# Altium schematic sheet Pop.SchDoc
size A3
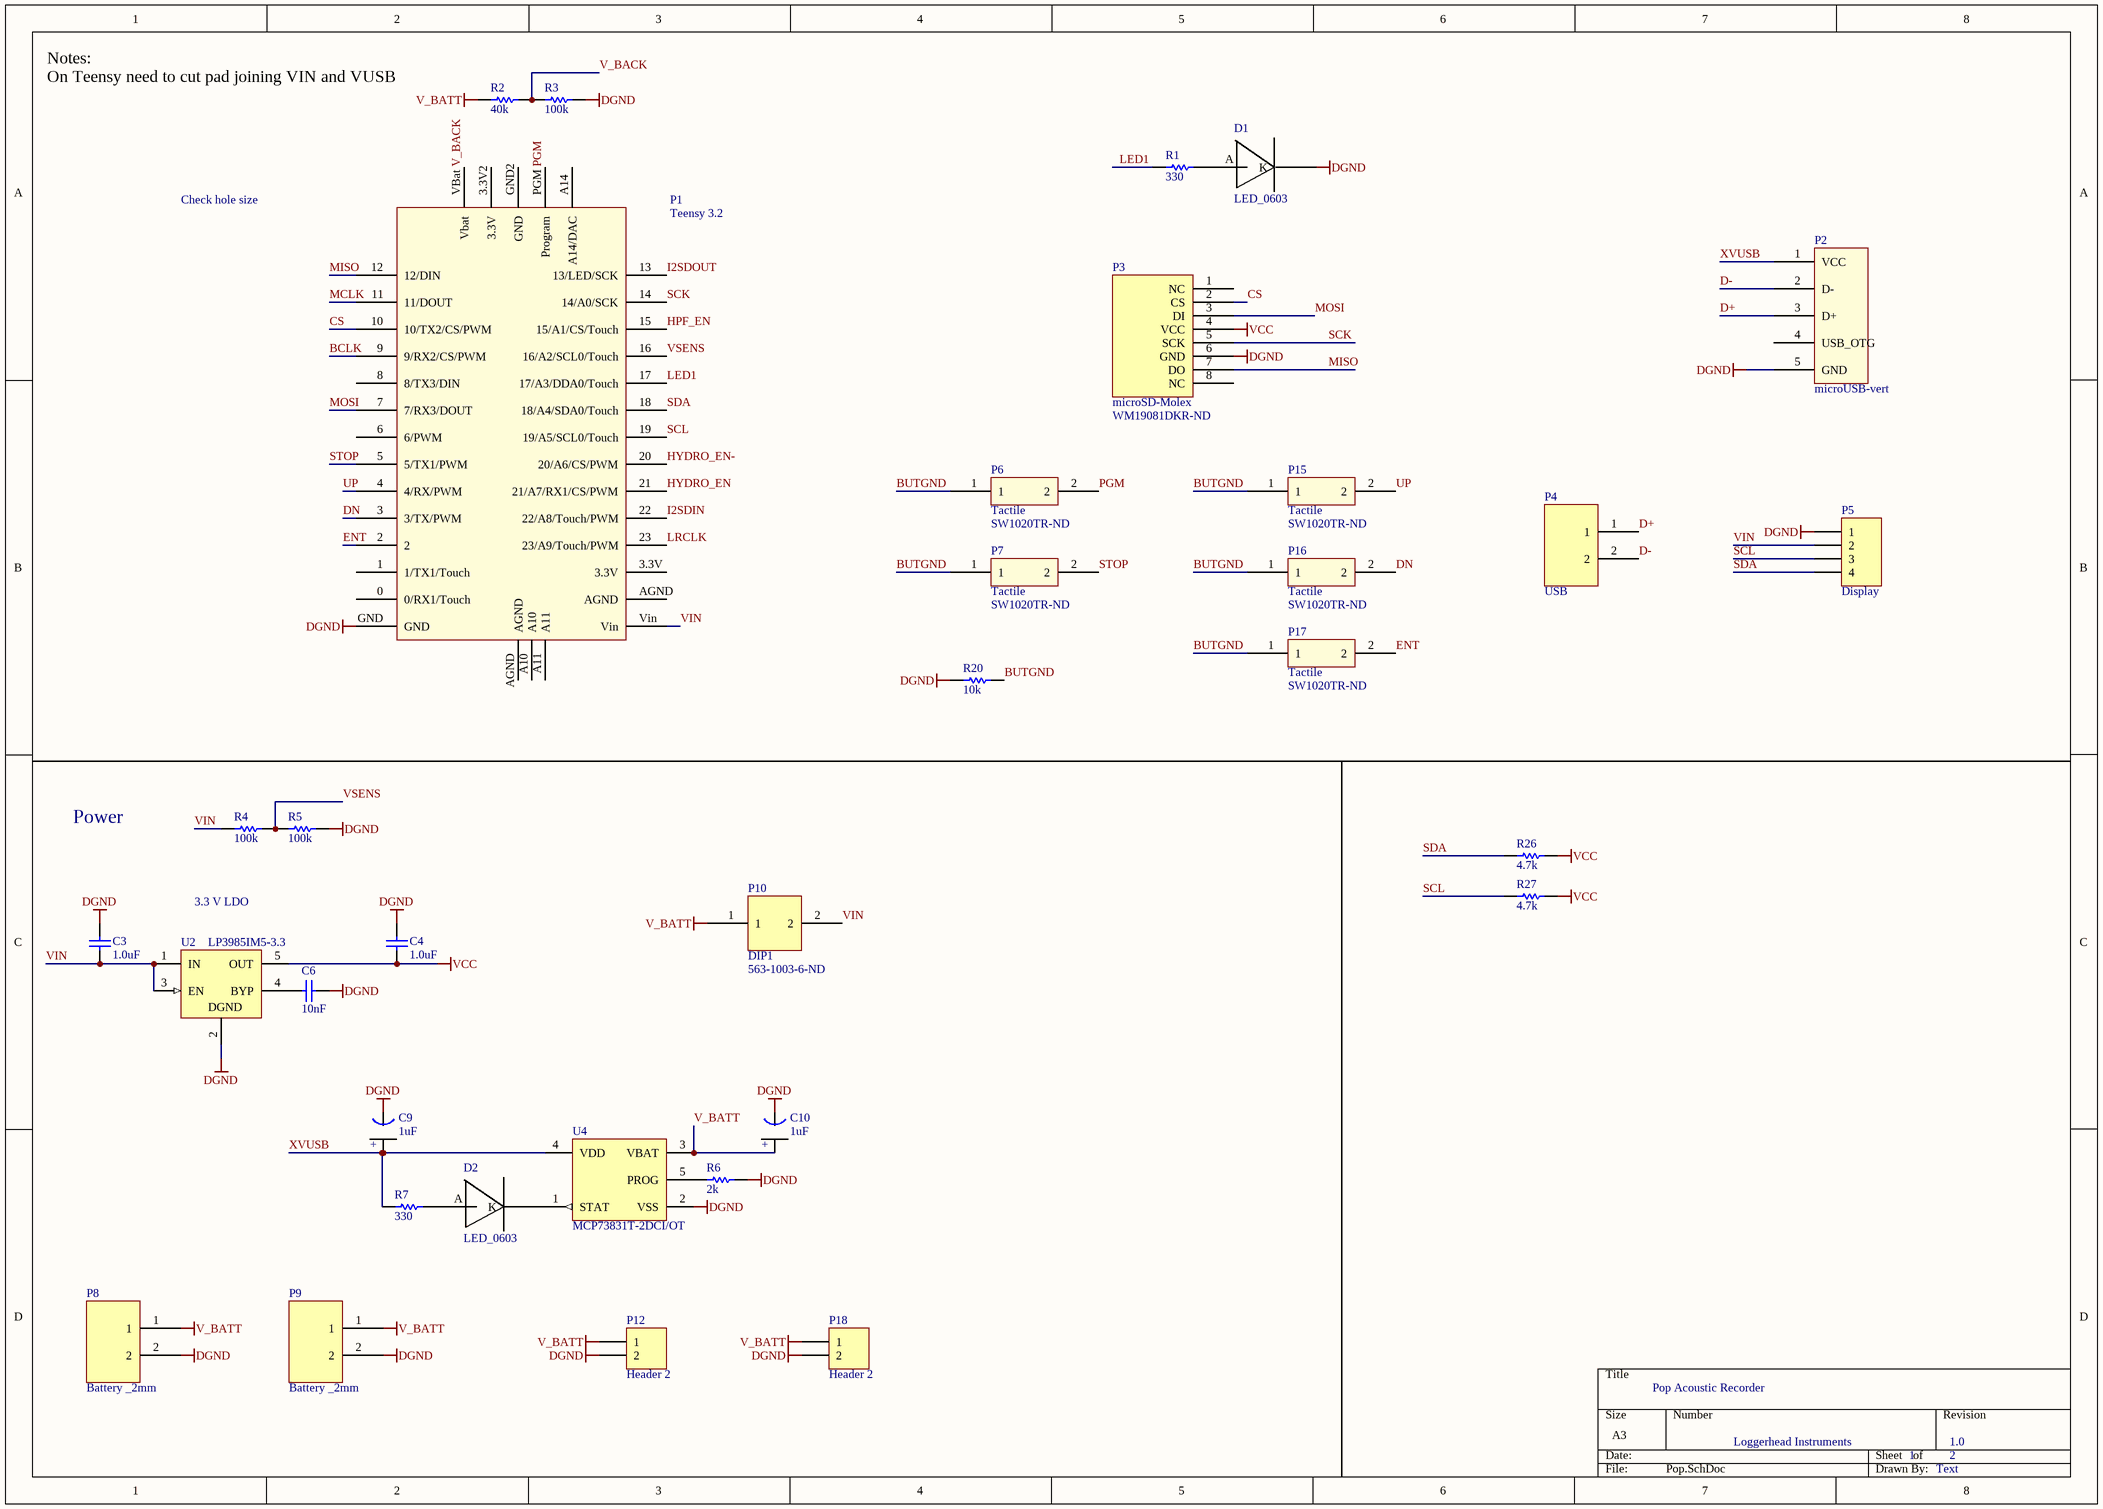
[diagram p0: Pop.SchDoc]

## Parts
C3  1.0uF  [0402]
C4  1.0uF  [0402]
C6  10nF  [0402]
C9  1uF  [Tant0805]
C10  1uF  [Tant0805]
D1  LED_0603  [Diode0603]
D2  LED_0603  [Diode0603]
P1  Teensy 3.2  [Teensy3.x]
P2  microUSB-vert  [MICROUSB-VERT]
P3  microSD-Molex  Supplier Part Number 1: WM19081DKR-ND  [microSD_Molex_hinged]
P4  USB  [HDR_2x1_2mm]
P5  Display  [HDR1X4]
P6  Tactile  Supplier Part Number 1: SW1020TR-ND  [Tactile-B3U-1000]
P7  Tactile  Supplier Part Number 1: SW1020TR-ND  [Tactile-B3U-1000]
P8  Battery _2mm  [HDR_2x1_2mm]
P9  Battery _2mm  [HDR_2x1_2mm]
P10  DIP1  Supplier Part Number 1: 563-1003-6-ND  [DIP1]
P12  Header 2  [HDR1X2]
P15  Tactile  Supplier Part Number 1: SW1020TR-ND  [Tactile-B3U-1000]
P16  Tactile  Supplier Part Number 1: SW1020TR-ND  [Tactile-B3U-1000]
P17  Tactile  Supplier Part Number 1: SW1020TR-ND  [Tactile-B3U-1000]
P18  Header 2  [HDR1X2]
R1  330  [3-0603]
R2  40k  [3-0603]
R3  100k  [3-0603]
R4  100k  [3-0603]
R5  100k  [3-0603]
R6  2k  [3-0603]
R7  330  [3-0603]
R20  10k  [3-0603]
R26  4.7k  [3-0603]
R27  4.7k  [3-0603]
U2  LP3985IM5-3.3  [MF05A_N]
U4  MCP73831T-2DCI/OT  [SOT-23-OT5_N]

## Nets
DGND: C3.2 C4.2 C6.1 C9.1(GND) C10.1(GND) D1.K P1.GND P2.5(GND) P3.6(GND) P5.1 P8.2 P9.2 P12.2 P18.2 R3.1 R5.1 R6.1 R20.2 U2.2(GND) U4.2(VSS)
V_BATT: C10.2(+) P8.1 P9.1 P10.1 P12.1 P18.1 R2.2 U4.3(VBAT)
VCC: C4.1 P3.4(VCC) R26.1 R27.2 U2.5(OUT)
BCLK: P1.9(9/RX2/CS/PWM)
BUTGND: P6.1 P7.1 P15.1 P16.1 P17.1 R20.1
CS: P1.10(10/TX2/CS/PWM) P3.2(CS)
D+: P2.3(D+) P4.1
D-: P2.2(D-) P4.2
DN: P1.3(3/TX/PWM) P16.2
ENT: P1.2 P17.2
HPF_EN: P1.15(15/A1/CS/Touch)
HYDRO_EN: P1.21(21/A7/RX1/CS/PWM)
HYDRO_EN-: P1.20(20/A6/CS/PWM)
I2SDIN: P1.22(22/A8/Touch/PWM)
I2SDOUT: P1.13(13/LED/SCK)
LED1: P1.17(17/A3/DDA0/Touch) R1.1
LRCLK: P1.23(23/A9/Touch/PWM)
MCLK: P1.11(11/DOUT)
MISO: P1.12(12/DIN) P3.7(DO)
MOSI: P1.7(7/RX3/DOUT) P3.3(DI)
PGM: P1.PGM(Program) P6.2
SCK: P1.14(14/A0/SCK) P3.5(SCK)
SCL: P1.19(19/A5/SCL0/Touch) P5.3 R27.1
SDA: P1.18(18/A4/SDA0/Touch) P5.4 R26.2
STOP: P1.5(5/TX1/PWM) P7.2
UP: P1.4(4/RX/PWM) P15.2
V_BACK: P1.VBat(Vbat) R2.1 R3.2
VIN: C3.1 P1.Vin P5.2 P10.2 R4.2 U2.1(IN) U2.3(EN)
VSENS: P1.16(16/A2/SCL0/Touch) R4.1 R5.2
XVUSB: C9.2(+) P2.1(VCC) R7.1 U4.4(VDD)
NetC6_2: C6.2 U2.4(BYP)
NetD1_A: D1.A R1.2
NetD2_A: D2.A R7.2
NetD2_K: D2.K U4.1(STAT)
NetR6_2: R6.2 U4.5(PROG)

Not connected (* = marked no-connect by the designer): P1 0(0/RX1/Touch) 1(1/TX1/Touch) 3.3V 3.3V2(3.3V) 6(6/PWM) 8(8/TX3/DIN) A10 A11 A14(A14/DAC) AGND GND2(GND); P2 4(USB_OTG); P3 1(NC) 8(NC)

## Notes on the sheet
- Notes:
  On Teensy need to cut pad joining VIN and VUSB
- Check hole size
- Power
- 3.3 V LDO
- Pop Acoustic Recorder
- Loggerhead Instruments
- 1
- 1.0
- 2
- Text
- (in symbol LP3985IM5-3.3) DGND

## Library data of the parts
C3 C4 C6 = C0402: Ceramic Chip Capacitor - Standard; Note: Footprint corresponds to dimensions for bulk cassette packaging. This case size has tightened tolerances.; Value: 0.1uF; Published: 17-Jul-2002; LatestRevisionDate: 19-Mar-2004; LatestRevisionNote: Silkscreen size reduced.; DatasheetDocument: Mar-2001; PackageDocument: Mar-2001; PackageReference: 0402; Publisher: Altium Limited; Code_JEITA: 0402; Code_IPC: 1005 [0402]; ComponentLink1Description: Manufacturer Link; ComponentLink1URL: http://www.kemet.com/; ComponentLink2Description: Datasheet; ComponentLink2URL: http://www.kemet.com/kemet/web/homepage/kechome.nsf/vapubfilesname/F3102TA.pdf/$file/F3102TA.pdf
C9 C10 = Tant0805: Value: 1uF
P1 = Teensy3.x
P2 = microUSB-vert: Molex 105133-0011
P3 = microSD_Molex_hinged: Supplier 1: Digi-Key
P4 P8 P9 = HDR_2x1_2mm: Charging Connector
P5 = Header 4: Header, 4-Pin; LatestRevisionDate: 17-Jul-2002; LatestRevisionNote: Re-released for DXP Platform.; Publisher: Altium Limited
P6 P7 P15-P17 = Tactile_B3U-1000: Supplier 1: Digi-Key
P12 P18 = Header 2: Header, 2-Pin; LatestRevisionDate: 17-Jul-2002; LatestRevisionNote: Re-released for DXP Platform.; Publisher: Altium Limited
R1-R7 R20 R26 R27 = ERJ3RK: Precision Thick Film Chip Resistor, 10 Ohm to 1M Ohm Range, 1% and 0.5% Tolerance, 0603 Size, 0.063 W; Published: 17-Dec-2003; LatestRevisionDate: 19-Mar-2004; LatestRevisionNote: Silkscreen size reduced.; PackageDocument: Mar-2003; PackageReference: 3-0603; Publisher: Altium Limited; Code_IPC: 1608 [0603]; ComponentLink1Description: Manufacturer Link; ComponentLink1URL: http://www.panasonic.com/industrial/components/resistive_products.htm; ComponentLink2Description: Datasheet; ComponentLink2URL: http://www.panasonic.com/industrial/components/pdf/AOA0000CE2.pdf
U2 = LP3985IM5-3.3: Micropower, 150mA Low-Noise Ultra Low-Dropout CMOS Voltage Regulator; Manufacturer: National Semiconductor; CompType: LDO IC; PackageTopMarking: LDQB*XTT; PowerWise: N; Published: 4-Dec-2008; DatasheetVersion: Aug-2005; PackageVersion: revD, Aug-2008; PackageReference: MF05A; Publisher: Altium Limited; PackageDescription: Molded SOT-23, .115 x .063 x .040 in Body, 5 Lead, .0375 in Pitch; PartNumber: LP3985IM5-3.3; RoHS: O; PinCount: 5; DigiKeyPartNumber: LP3985IM5-3.3CT-ND; ComponentLink1Description: LP3985 Datasheet; ComponentLink1URL: http://www.national.com/ds/LP/LP3985.pdf; ComponentLink2Description: LP3985 Web Page; ComponentLink2URL: http://www.national.com/pf/LP/LP3985.html; ComponentLink3Description: MF05A Package Page; ComponentLink3URL: http://www.national.com/packaging/folders/mf05a.html
U4 = MCP73831T-2DCI/OT: Miniature Single-Cell, Fully Integrated Li-Ion, Li-Polymer Charge Management Controller, 4.2V, 5-Pin SOT-23, Industrial Temperature, Tape and Reel; DatasheetVersion: revE, Sep-2008; PackageVersion: revBB, Aug-2009; PackageReference: SOT-23-OT5; PackageDescription: 5-Lead Plastic Small Outline Transistor (OT) [SOT-23]; Code_IPC: SOT23-5; ComponentLink1Description: Manufacturer URL; ComponentLink1URL: http://www.microchip.com/; ComponentLink2Description: Datasheet; ComponentLink2URL: http://ww1.microchip.com/downloads/en/DeviceDoc/21984e.pdf; ComponentLink3Description: Package Specification; ComponentLink3URL: http://www.microchip.com/stellent/groups/techpub_sg/documents/packagingspec/en012702.pdf
P10 = DIP1: Supplier 1: Digi-Key